# Altium schematic sheet VI Sensors.SchDoc
size A4; SheetNumber: 11; SheetTotal: 11
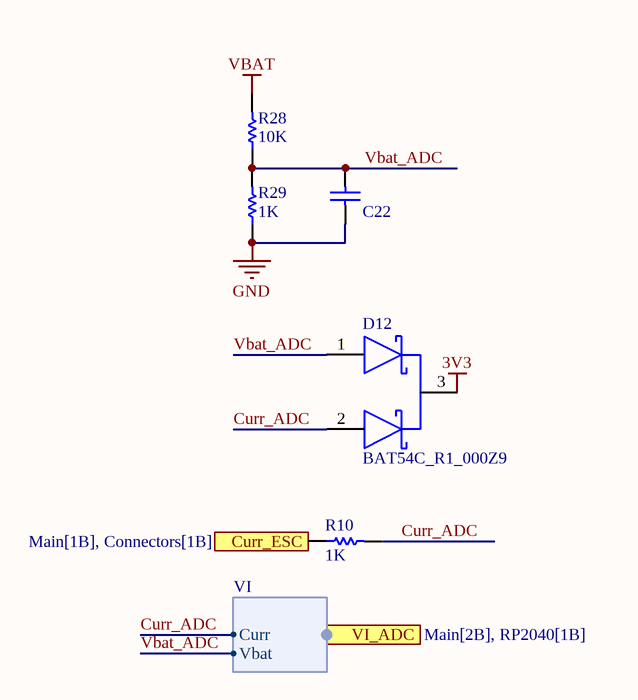
[diagram p0: VI Sensors.SchDoc]

## Parts
C22  1µF  [WCAP-CSGP_0603_L1.6W0.8H0.8_Reflow]  (value not drawn)
D12  BAT54C_R1_000Z9  [FP-SOT23-MFG]
R10  1K  [RESC0603(1608)_N]
R28  10K  [RESC0603(1608)_N]
R29  1K  [RESC0603(1608)_N]

## Ports
Curr_ESC (see Main[1B], Connectors[1B]), VI_ADC (harness VI, see Main[2B], RP2040[1B])

## Harnesses
VI: Curr, Vbat

## Nets
3V3: D12.3(COMMON_CATHODE)
GND: C22.1 R29.1
VBAT: R28.2
Curr_ADC: D12.2(2_ANODE) R10.2 ; port VI_ADC.Curr
Curr_ESC: R10.1 ; port Curr_ESC
Vbat_ADC: C22.2 D12.1(1_ANODE) R28.1 R29.2 ; port VI_ADC.Vbat

## Library data of the parts
C22 = 885012106017: WCAP-CSGP Multilayer Ceramic Chip Capacitor, General Purpose, size 0603, X5R, 1µF, 16VDC; Manufacturer: Wurth Elektronik; Case/Size Code: 0603; Capacitance Tolerance: +/-20%; Dissipation Factor: 10%; Insulation Resistance: 0.1GΩ; Rated Voltage (DC): 16V; Technical Reference: X5R0603105M016DFCT10000; ComponentLink1Description: Website Link; ComponentLink1URL: https://www.we-online.com/redexpert/article/885012106017?ad; ComponentLink2Description: Datasheet Link; ComponentLink2URL: https://www.we-online.com/redexpert/spec/885012106017?ad; Manufacturer Part Number: 885012106017; Category: Multilayer Ceramic Chip Capacitors; Match Code: WCAP-CSGP; Mount: Surface Mount; Operating Temperature Max: 85°C; Operating Temperature Min: -55°C; Packaging: Tape and Reel; Length: 1.6mm; Width: 0.8mm; Height: 0.8mm; Capacitance: 1µF; Ceramic Type: X5R
D12 = CMP-14398-000007-1: DIODE ARRAY SCHOTTKY 30V SOT23; Manufacturer: Nexperia; Manufacturer Part Number: BAT54C,215; Automotive Grade: Grade 0; Peak Reverse Current: 2uA; Forward Current: 200mA; Max Surge Forward Current: 600mA; Value: 10pF; Max Junction Temp: +150°C; Description: Diode Array 1 Pair Common Cathode Schottky 30V 200mA (DC) Surface Mount TO-236-3, SC-59, SOT-23-3; Lead Free: Yes; Automotive: Yes; Device Class L1: Discrete Semiconductors; Digikey Description: DIODE ARRAY SCHOTTKY 30V SOT23; Reverse Voltage: 30V; ComponentLink2URL: https://assets.nexperia.com/documents/data-sheet/BAT54_SER.pdf; Device Class L2: Diodes; Category: Diode; Octopart: https://octopart.com/bat54c%2C215-nexperia-78738945; Package: SOT23; Mouser Description: Schottky Diodes, Rectifiers - Arrays SOT-23 (TO-236AB) 30V 200mA (DC) Surface Mount; RoHS: TRUE; Temperature: to +150°C; Ambient Temperature Range Low: -55°C; Height: 1.1mm; Device Class L3: Schottky Diodes; Temperature Range High: +150°C; Footprint Url: https://assets.nexperia.com/documents/outline-drawing/SOT23.pdf; Capacitance: 10pF; Ambient Temperature Range High: +150°C; Ipc Land Pattern Name: SOT95P230X100-3; ComponentLink2Description: Datasheet
R10 = Res 1K: Chipwiderstand, SMD, Baureihe MC, 1%; Manufacturer: Multicomp; PackageReference: 0603; Value: 1K; OC_FARNELL: 9330380
R28 = Res 100K: Chipwiderstand, SMD, Baureihe MC, 1%; Manufacturer: Multicomp; Value: 100K; PackageReference: 0603; OC_FARNELL: 9330402
R29 = Res 10K: Chipwiderstand, SMD, Baureihe MC, 1%; Manufacturer: Multicomp; Value: 10K; PackageReference: 0603; OC_FARNELL: 9330399